# Altium schematic sheet [09] - CPU - UART, AUDIO.SchDoc
size A2; DocumentNumber: 9; SheetNumber: 9; SheetTotal: 20
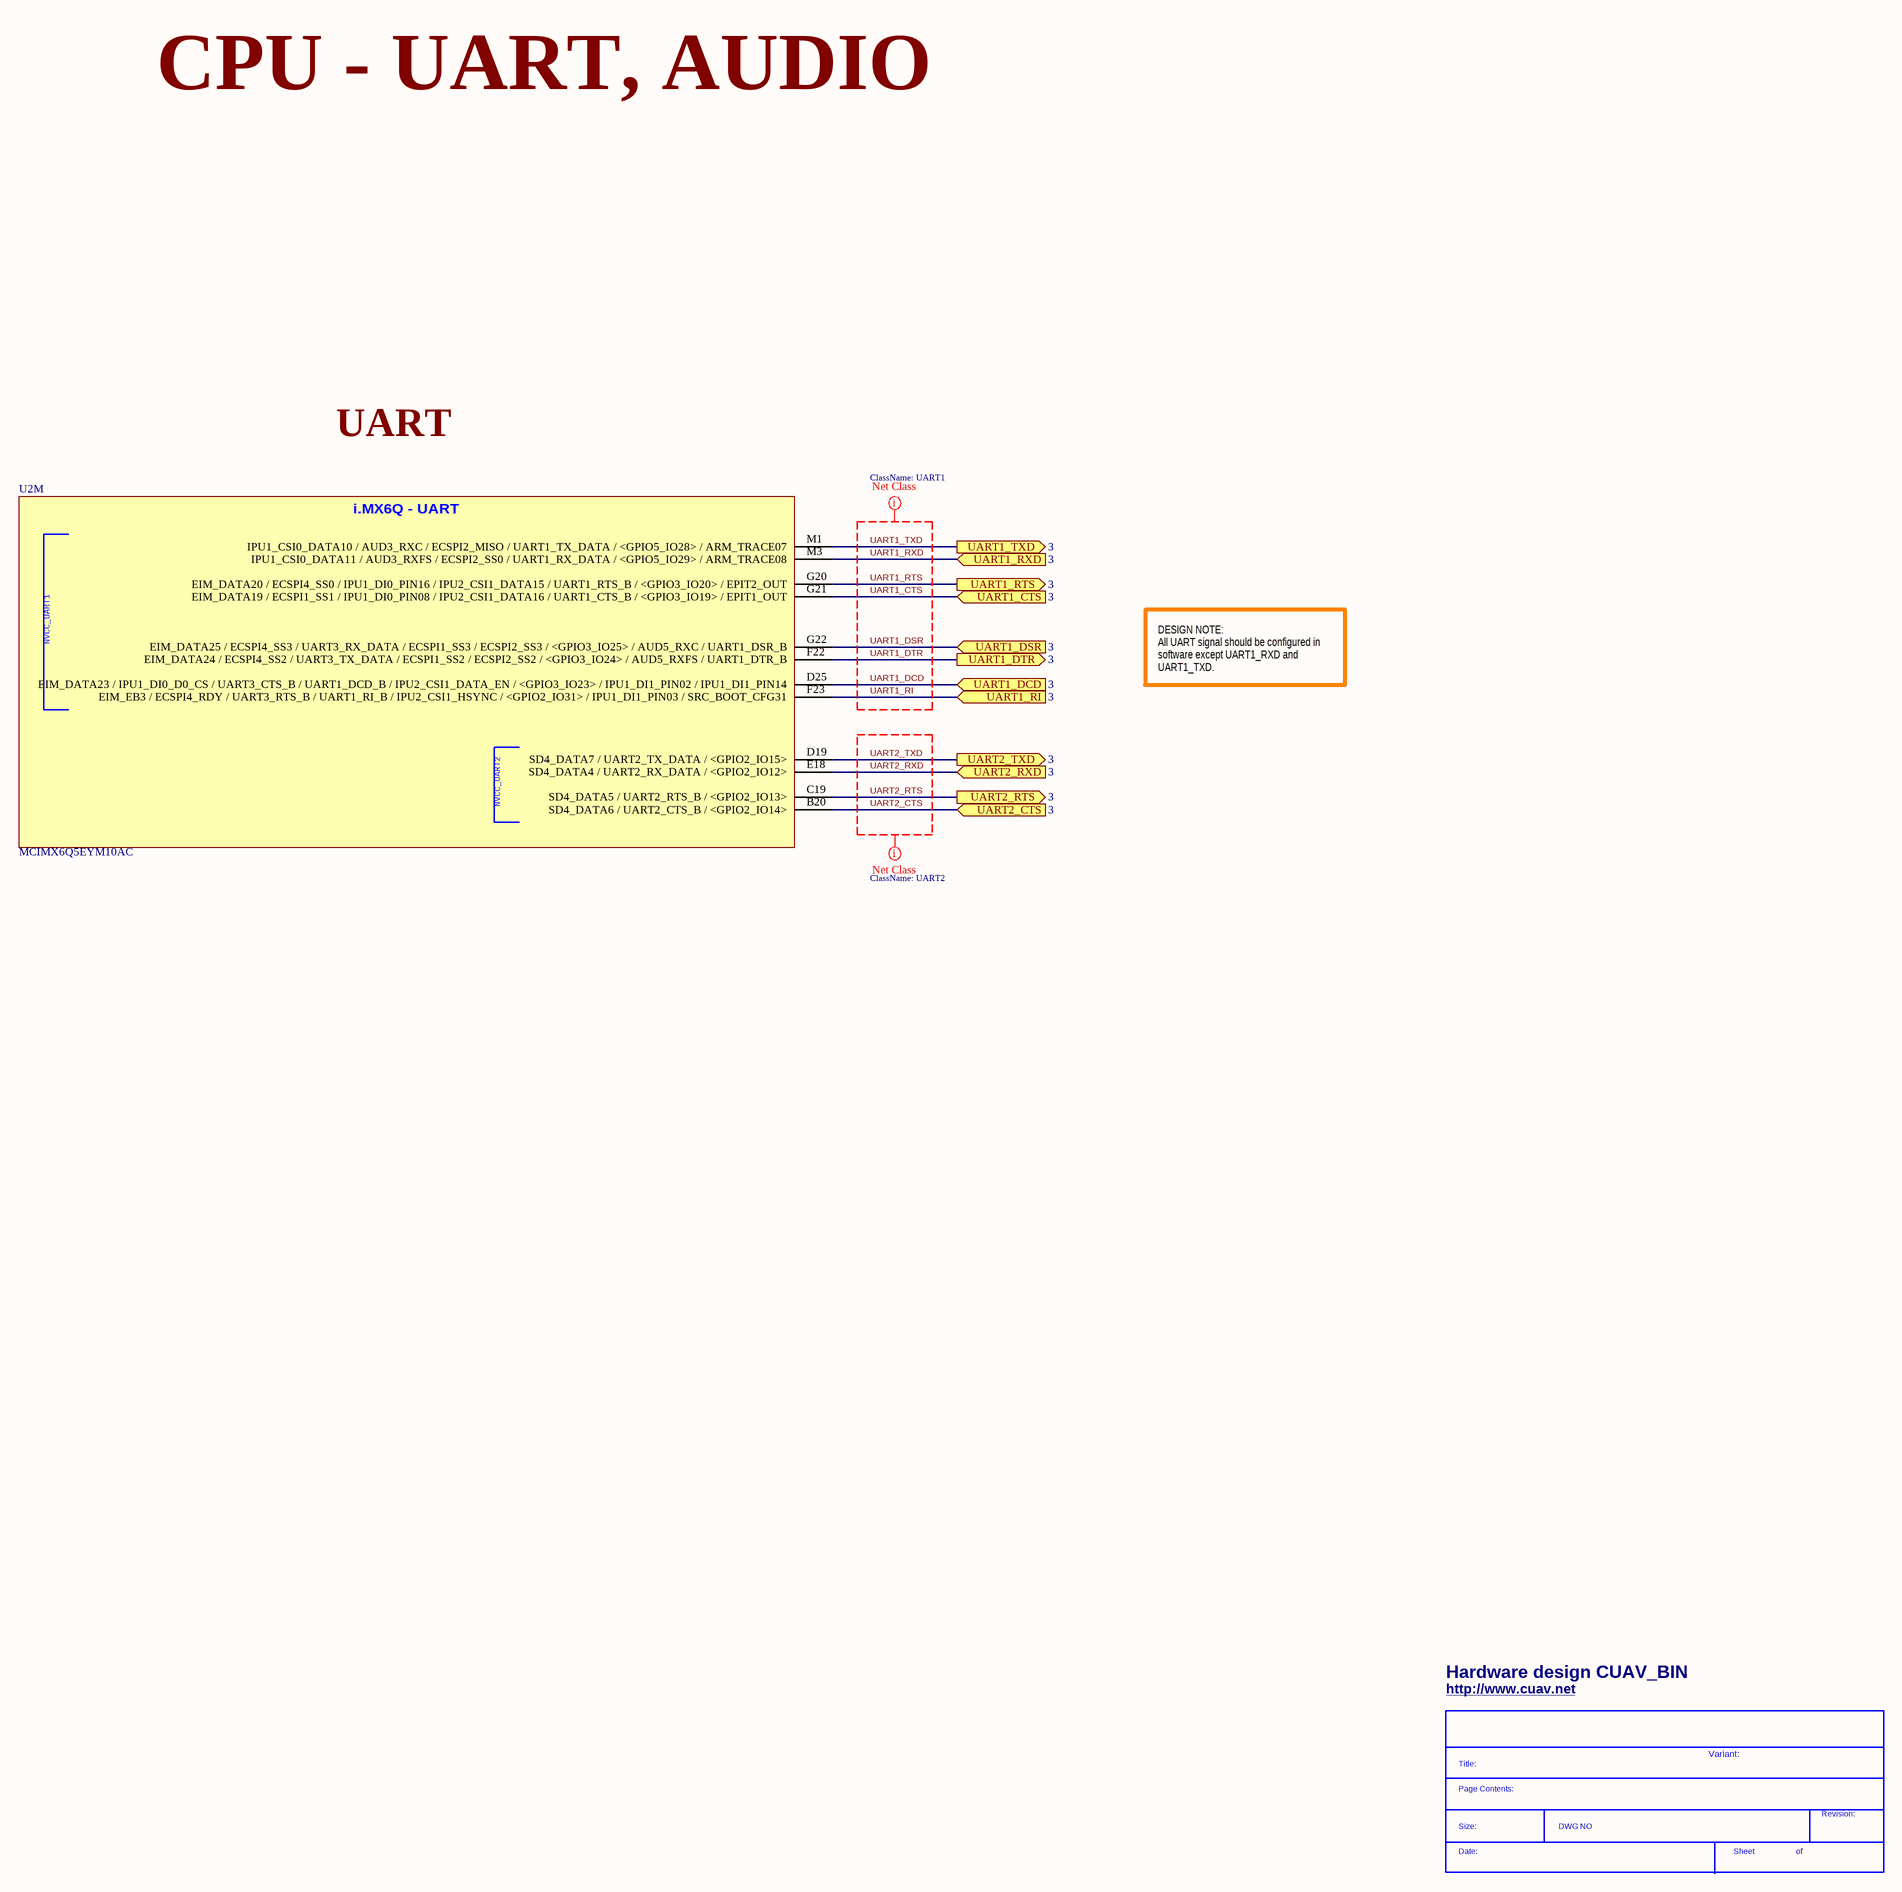
[diagram p0: [09] - CPU - UART, AUDIO.SchDoc]

## Parts
*  SDTitleBlock  (value not drawn)  (graphical)
U2  MCIMX6Q5EYM10AC  [PBGA624]  (part M of 15)

## Ports
UART1_CTS (in, see 3), UART1_DCD (in, see 3), UART1_DSR (in, see 3), UART1_DTR (out, see 3), UART1_RI (in, see 3), UART1_RTS (out, see 3), UART1_RXD (in, see 3), UART1_TXD (out, see 3), UART2_CTS (in, see 3), UART2_RTS (out, see 3), UART2_RXD (in, see 3), UART2_TXD (out, see 3)

## Nets
UART1_CTS: U2.G21(EIM_DATA19_/_ECSPI1_SS1_/_IPU1_DI0_PIN08_/_IPU2_CSI1_DATA16_/_UART1_CTS_B_/_<GPIO3_IO19>_/_EPIT1_OUT) ; port UART1_CTS
UART1_DCD: U2.D25(EIM_DATA23_/_IPU1_DI0_D0_CS_/_UART3_CTS_B_/_UART1_DCD_B_/_IPU2_CSI1_DATA_EN_/_<GPIO3_IO23>_/_IPU1_DI1_PIN02_/_IPU1_DI1_PIN14) ; port UART1_DCD
UART1_DSR: U2.G22(EIM_DATA25_/_ECSPI4_SS3_/_UART3_RX_DATA_/_ECSPI1_SS3_/_ECSPI2_SS3_/_<GPIO3_IO25>_/_AUD5_RXC_/_UART1_DSR_B) ; port UART1_DSR
UART1_DTR: U2.F22(EIM_DATA24_/_ECSPI4_SS2_/_UART3_TX_DATA_/_ECSPI1_SS2_/_ECSPI2_SS2_/_<GPIO3_IO24>_/_AUD5_RXFS_/_UART1_DTR_B) ; port UART1_DTR
UART1_RI: U2.F23(EIM_EB3_/_ECSPI4_RDY_/_UART3_RTS_B_/_UART1_RI_B_/_IPU2_CSI1_HSYNC_/_<GPIO2_IO31>_/_IPU1_DI1_PIN03_/_SRC_BOOT_CFG31) ; port UART1_RI
UART1_RTS: U2.G20(EIM_DATA20_/_ECSPI4_SS0_/_IPU1_DI0_PIN16_/_IPU2_CSI1_DATA15_/_UART1_RTS_B_/_<GPIO3_IO20>_/_EPIT2_OUT) ; port UART1_RTS
UART1_RXD: U2.M3(IPU1_CSI0_DATA11_/_AUD3_RXFS_/_ECSPI2_SS0_/_UART1_RX_DATA_/_<GPIO5_IO29>_/_ARM_TRACE08) ; port UART1_RXD
UART1_TXD: U2.M1(IPU1_CSI0_DATA10_/_AUD3_RXC_/_ECSPI2_MISO_/_UART1_TX_DATA_/_<GPIO5_IO28>_/_ARM_TRACE07) ; port UART1_TXD
UART2_CTS: U2.B20(SD4_DATA6_/_UART2_CTS_B_/_<GPIO2_IO14>) ; port UART2_CTS
UART2_RTS: U2.C19(SD4_DATA5_/_UART2_RTS_B_/_<GPIO2_IO13>) ; port UART2_RTS
UART2_RXD: U2.E18(SD4_DATA4_/_UART2_RX_DATA_/_<GPIO2_IO12>) ; port UART2_RXD
UART2_TXD: U2.D19(SD4_DATA7_/_UART2_TX_DATA_/_<GPIO2_IO15>) ; port UART2_TXD

## Layout directives
net class UART1: UART1_CTS, UART1_DCD, UART1_DSR, UART1_DTR, UART1_RI, UART1_RTS, UART1_RXD, UART1_TXD
net class UART2: UART2_CTS, UART2_RTS, UART2_RXD, UART2_TXD

## Notes on the sheet
- CPU - UART, AUDIO
- UART
- DESIGN NOTE:
  All UART signal should be configured in software except UART1_RXD and UART1_TXD.
- (near *) Hardware design CUAV_BIN
- (near *) http://www.cuav.net
- Variant:
- (in symbol MCIMX6Q5EYM10AC, part M) i.MX6Q - UART; NVCC_UART1; NVCC_UART2
- (in symbol SDTitleBlock) Title:; Page Contents:; Revision:; Size:; DWG NO; Date:; Sheet; of

## Library data of the parts
U2 = MCIMX6Q5EYM10AC: IC MCU 32BIT ARM QUAD 624FCBGA; Manufacturer: Freescale Semiconductor; Core Processor: ARM?Cortex?A9; Core Size: 32-Bit Quad-Core; Speed: 1.0GHz; Connectivity: CAN, EBI/EMI, ESAI, Ethernet, GPMI, I2C, MMC/SD, PCI, SATA, SPI, UART, USB, USB OTG; Peripherals: DMA, HDMI, I2S/SSI/AC97, MIPI CSI, MIMI DSI, MIPI HIS, PWM, WDT; Number of I /O: 224; Program Memory Type: External Program Memory; RAM Size: 256K x 8; Voltage - Supply (Vcc/Vdd): 0.925 V ~ 1.5 V; Oscillator Type: Internal; .Creator: MM; .Checked PCB: MM, checked by RF; Supplier 1: Digi-Key; Manufacturer Part Number: MCIMX6Q5EYM10AC; RoHS: RoHS Compliant; Category: Integrated Circuits (ICs); Stock 1: 0; Pricing 1: 1=54.98, 10=51.922, 25=48.868, 100=30.5424 (USD); Program Memory Size: -; EEPROM Size: -; Data Converters: -; Operating Temperature: -20癈 ~ 105癈; Package / Case: 624-FBGA, FCBGA; Packaging: Tray; ComponentLink1URL: http://cache.freescale.com/files/32bit/doc/data_sheet/IMX6DQCEC.pdf; ComponentLink1Description: http://cache.freescale.com/files/32bit/doc/data_sheet/IMX6DQCEC.pdf; Supplier Part Number 1: MCIMX6Q5EYM10AC-ND; .Checked SCH: MM